# Altium project DHT11.PrjPCB
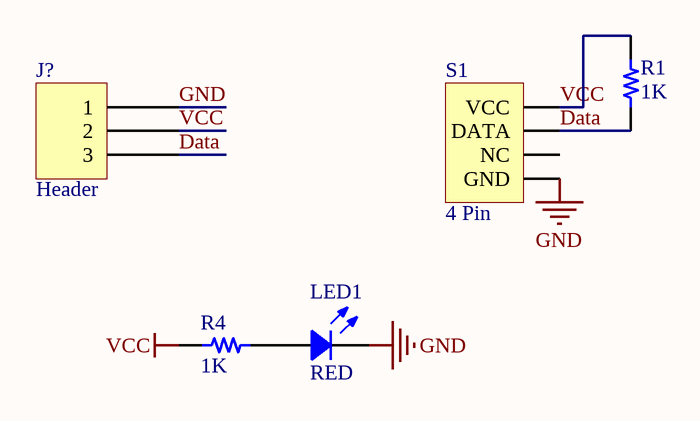
[diagram p0: DHT11.SchDoc]
1 sheet, 5 parts. Net scope: global (net labels, ports and power ports of the same name join across sheets).
Board file: DHT11.PcbDoc

## Sheet DHT11.SchDoc
size A

### Parts
J?  Header  [JST XH B3B-XH-A - RIGHT]
LED1  RED  [LED 0805/2012 RED]
R1  1K  [RES 1206/3216]
R4  1K  [RES 1206/3216]
S1  4 Pin  [DHT11]

### Nets
GND: J?.1 LED1.2 S1.4(GND)
VCC: J?.2 R1.2 R4.2 S1.1(VCC)
Data: J?.3 R1.1 S1.2(DATA)
NetLED1_1: LED1.1 R4.1

Not connected (* = marked no-connect by the designer): S1 3(NC)

### Library data of the parts
J? = 3 Pin
LED1 = LED: Chip LED; Value: Green
R1 R4 = Resistor: SMT Resistor; Value: 1K
S1 = DHT11